# Altium schematic sheet 01 COVER.SchDoc
size A3; Revision: V10; SheetNumber: 1; SheetTotal: 1
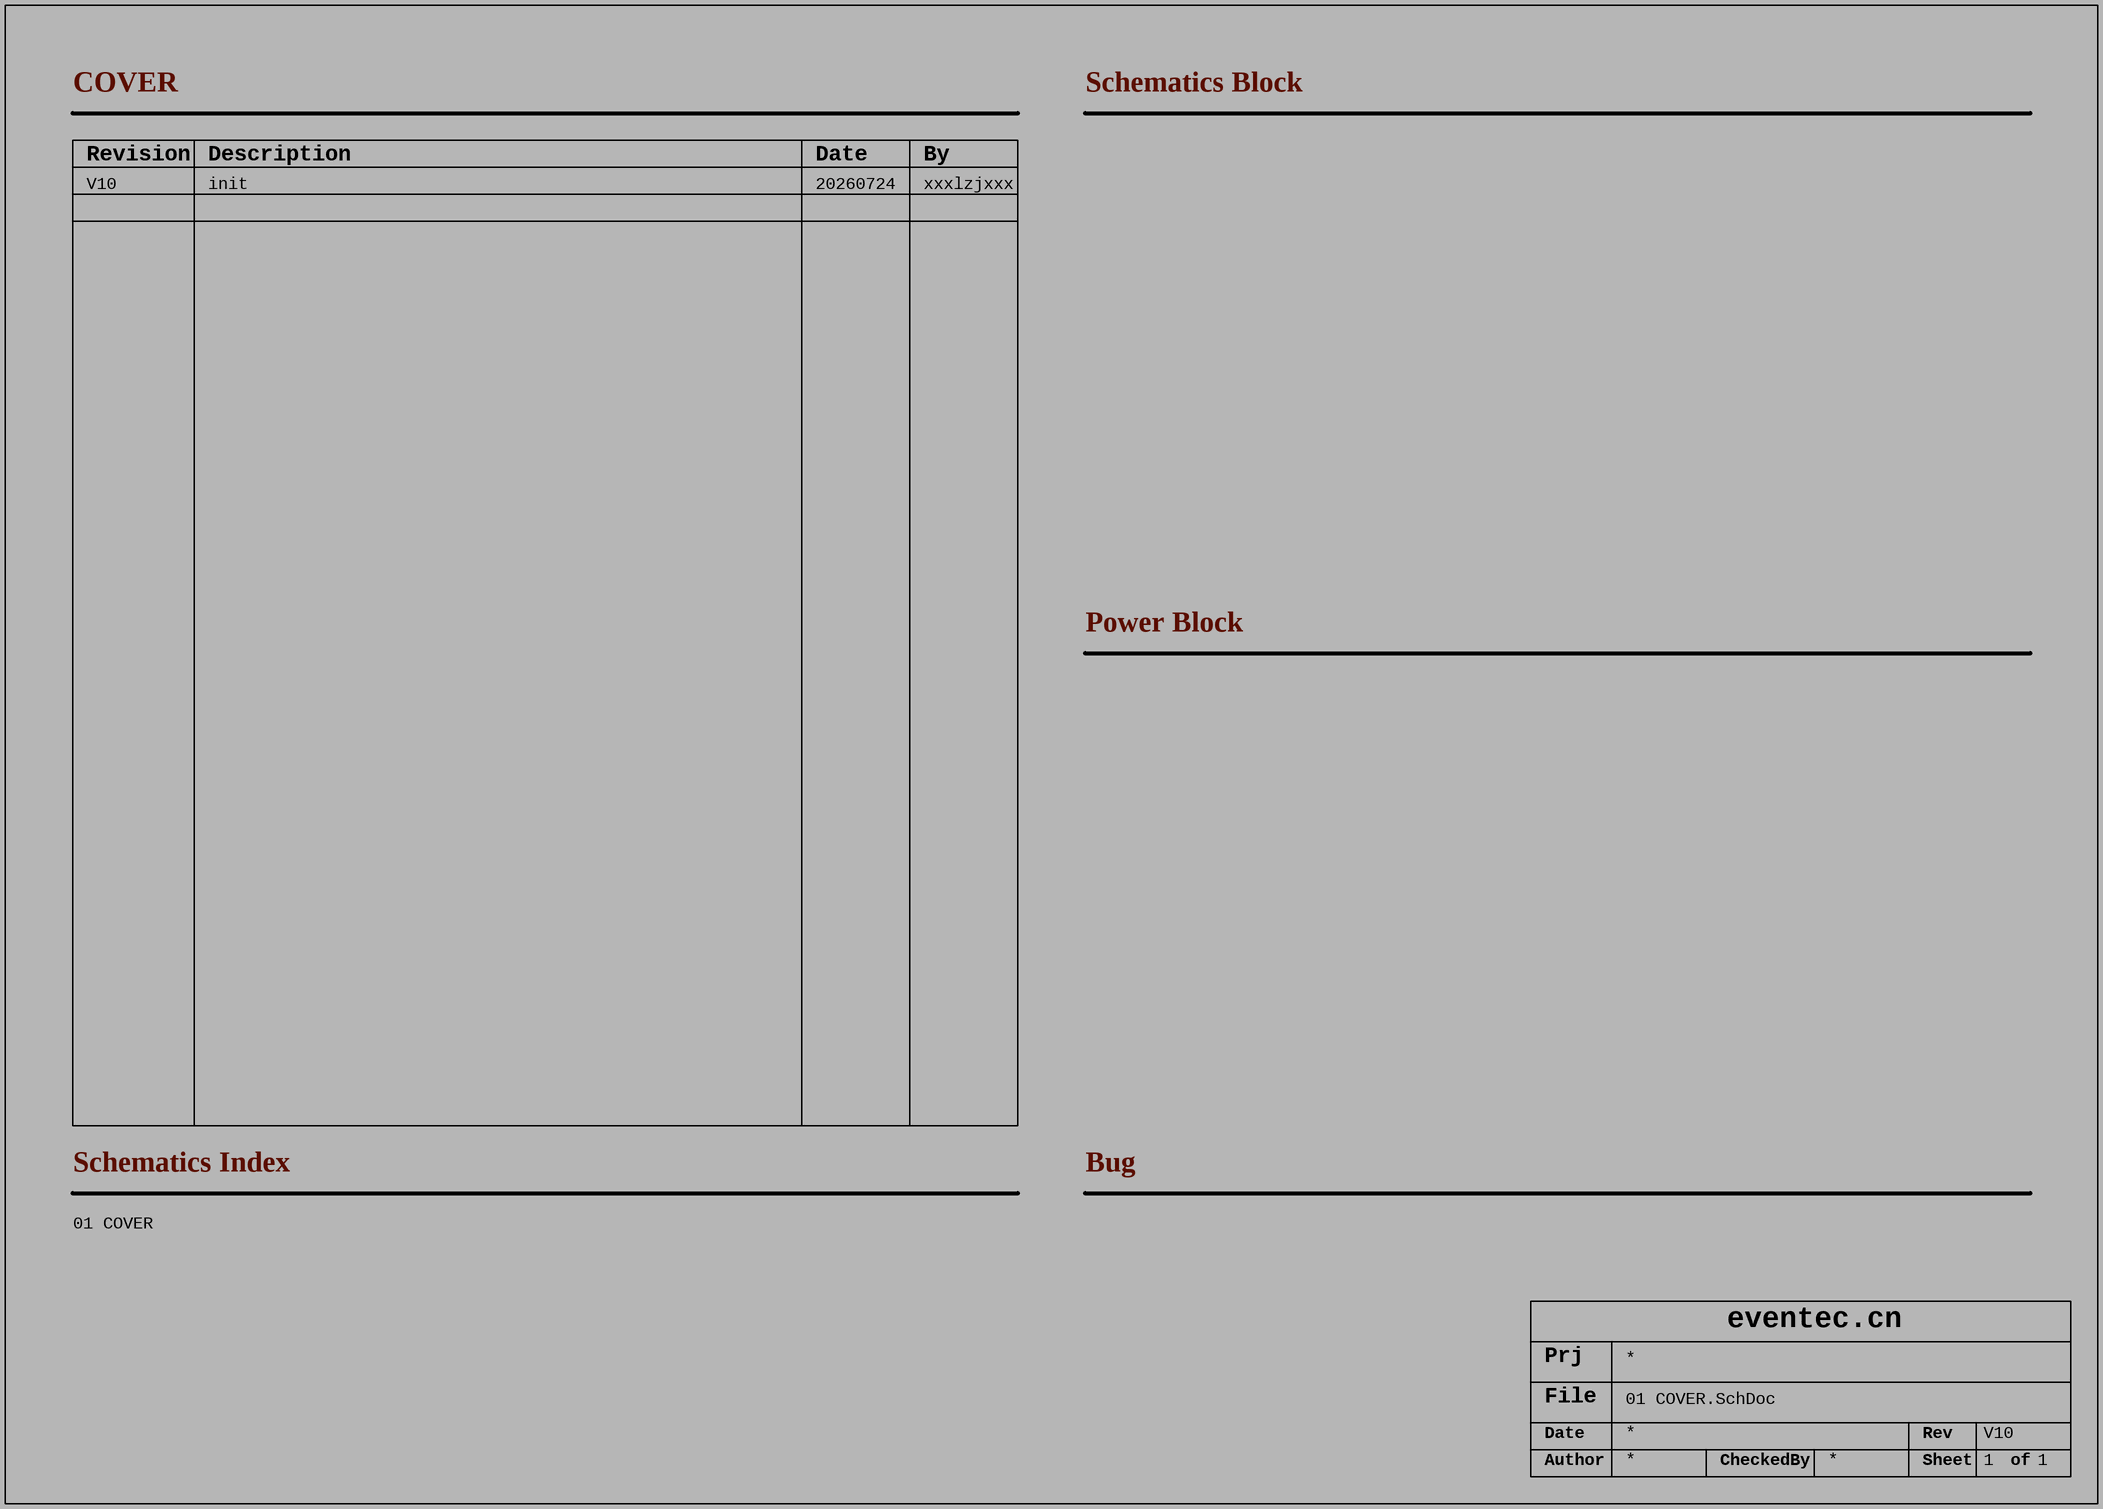
[diagram p0: 01 COVER.SchDoc]

## Notes on the sheet
- COVER
- Schematics Block
- Revision
- Description
- Date
- By
- V10
- init
- 20260724
- xxxlzjxxx
- Power Block
- Schematics Index
- Bug
- 01 COVER
- Prj
- eventec.cn
- File
- Rev
- Author
- CheckedBy
- Sheet
- of